# EAGLE design quadcopter (EAGLE 8.2.0)
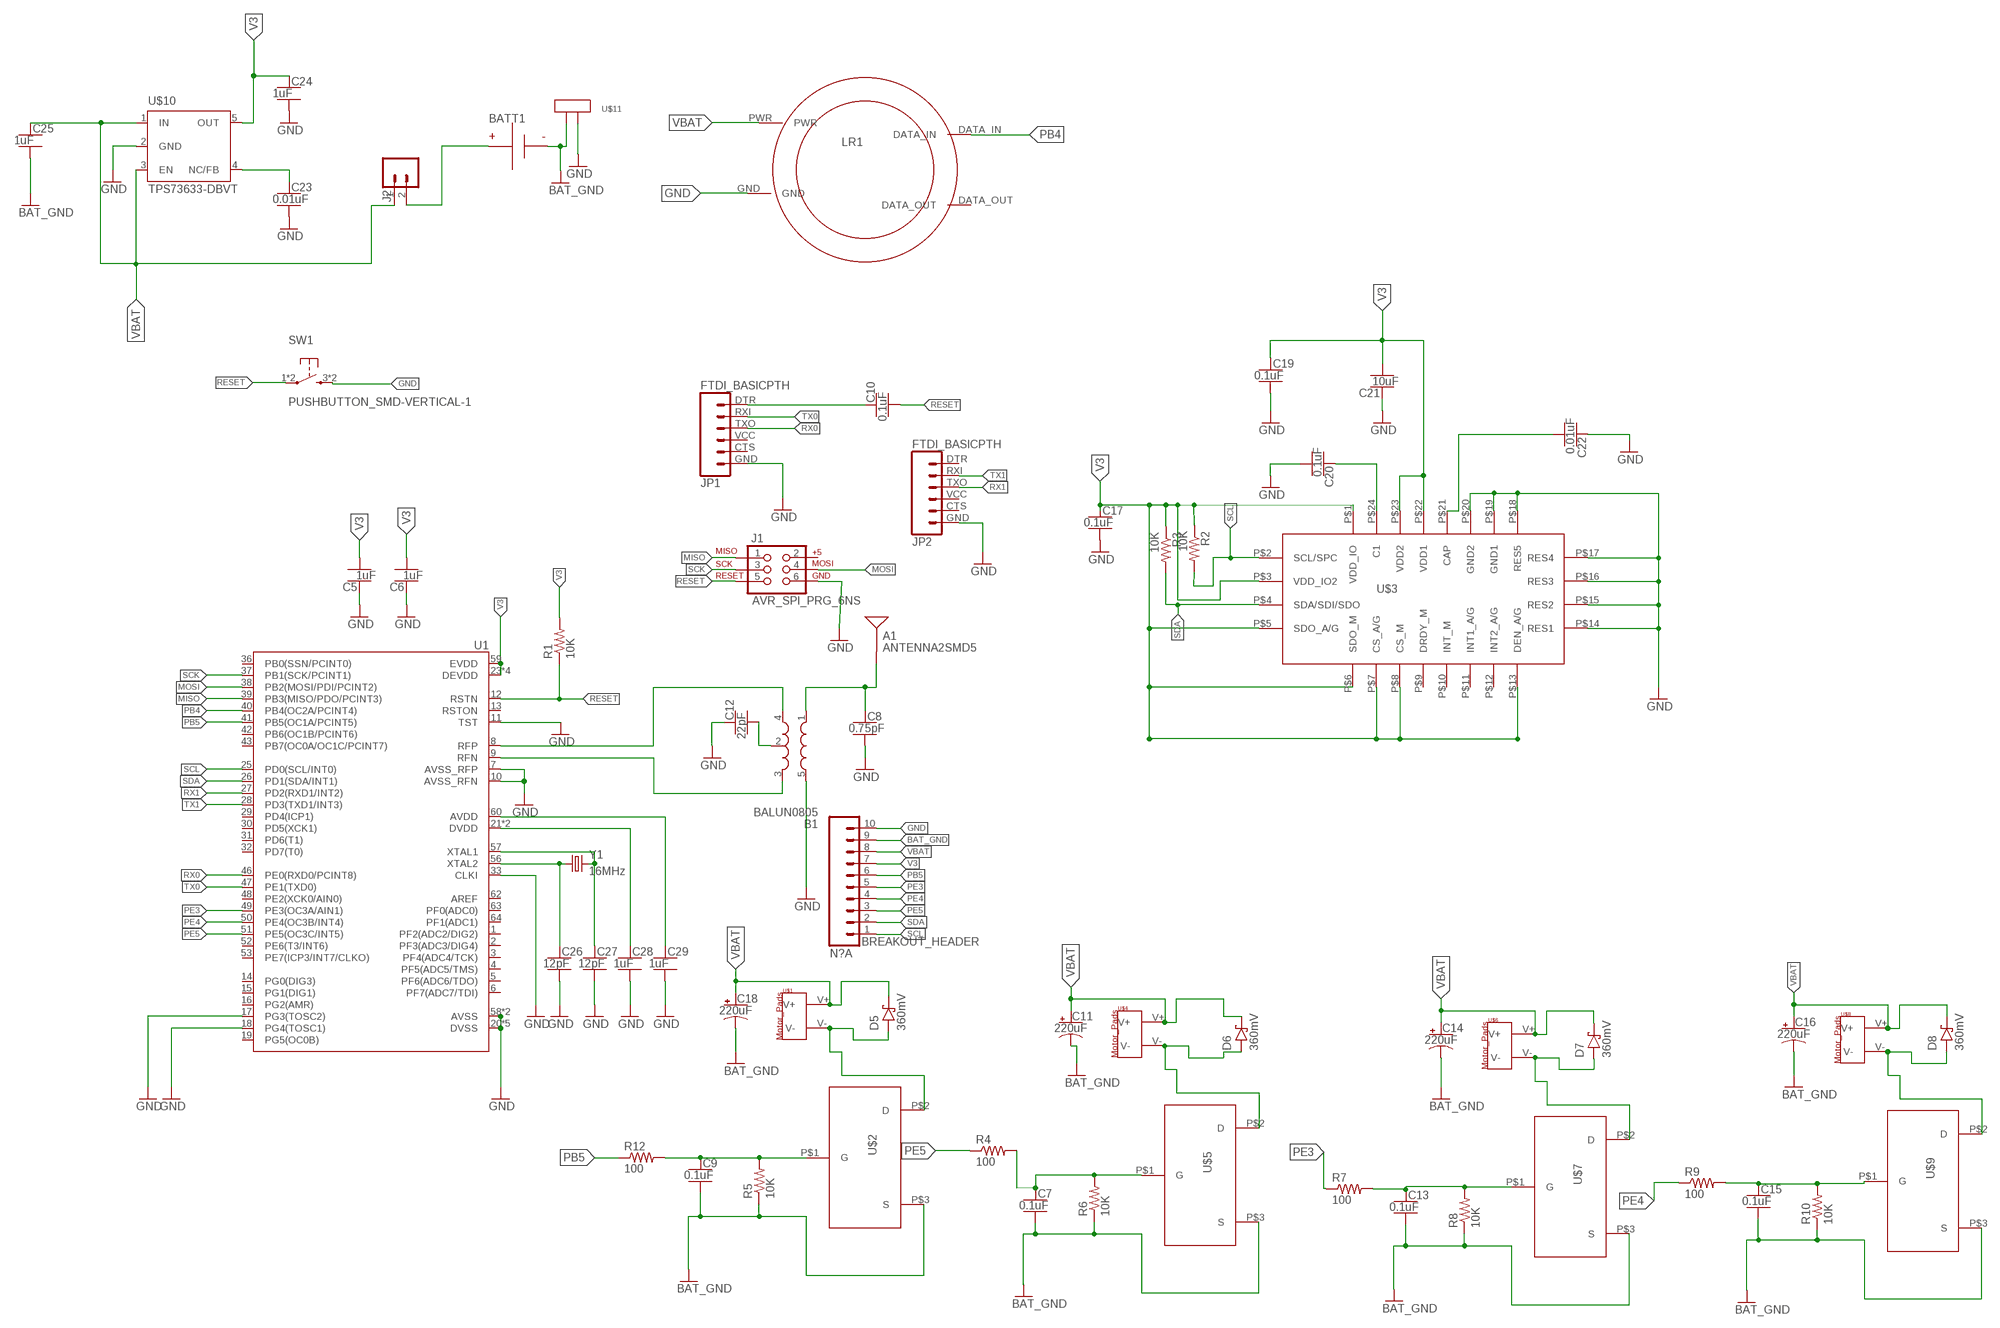
[diagram p0: schematic, sheet 1]

## Parts
A1  ANTENNA2SMD5  [ANTENNA-CHIP5]
B1  BALUN0805  [BALUN]
BATT1  BATTERY-HUBSAN-W/HOLDER  [BATTERY-W/HOLDER-380MAH-HUBSAN]
BREAKOUT_HEADER  N?A  SIP-10_TH-254X10  [HDRV10W63P254_10X1_2540X254H838_HS]
C5  1uF  CAPACITOR-NP_SMD-2012-0805_CERAMIC-1UF  [CAPC2012X140_HS]
C6  1uF  CAPACITOR-NP_SMD-2012-0805_CERAMIC-1UF  [CAPC2012X140_HS]
C7  0.1uF  CERAMIC_CAP-0805-0.1UF  [CERAMIC_CAP_0805]
C8  0.75pF  CAPACITOR-NP_SMD-2012-0805_CERAMIC-0.75PF  [CAPC2012X140_HS]
C9  0.1uF  CERAMIC_CAP-0805-0.1UF  [CERAMIC_CAP_0805]
C10  0.1uF  CAPACITOR-NP_SMD-2012-0805_CERAMIC-0.1UF  [CAPC2012X140_HS]
C11  220uF  CAPACITOR-POL_SMD-7043-D_TANTALUM-220UF  [CAPMP7343X310_HS]
C12  22pF  CAPACITOR-NP_SMD-2012-0805_CERAMIC-22PF  [CAPC2012X140_HS]
C13  0.1uF  CERAMIC_CAP-0805-0.1UF  [CERAMIC_CAP_0805]
C14  220uF  CAPACITOR-POL_SMD-7043-D_TANTALUM-220UF  [CAPMP7343X310_HS]
C15  0.1uF  CERAMIC_CAP-0805-0.1UF  [CERAMIC_CAP_0805]
C16  220uF  CAPACITOR-POL_SMD-7043-D_TANTALUM-220UF  [CAPMP7343X310_HS]
C17  0.1uF  CAPACITOR-NP_SMD-2012-0805_CERAMIC-0.1UF  [CAPC2012X140_HS]
C18  220uF  CAPACITOR-POL_SMD-7043-D_TANTALUM-220UF  [CAPMP7343X310_HS]
C19  0.1uF  CAPACITOR-NP_SMD-2012-0805_CERAMIC-0.1UF  [CAPC2012X140_HS]
C20  0.1uF  CAPACITOR-NP_SMD-2012-0805_CERAMIC-0.1UF  [CAPC2012X140_HS]
C21  10uF  CAPACITOR-NP_SMD-2012-0805_CERAMIC-10UF  [CAPC2012X140_HS]
C22  0.01uF  CAPACITOR-NP_SMD-2012-0805_CERAMIC-0.01UF  [CAPC2012X140_HS]
C23  0.01uF  CAPACITOR-NP_SMD-2012-0805_CERAMIC-0.01UF  [CAPC2012X140_HS]
C24  1uF  CAPACITOR-NP_SMD-2012-0805_CERAMIC-1UF  [CAPC2012X140_HS]
C25  1uF  CAPACITOR-NP_SMD-2012-0805_CERAMIC-1UF  [CAPC2012X140_HS]
C26  12pF  CAPACITOR-NP_SMD-2012-0805_CERAMIC-12PF  [CAPC2012X140_HS]
C27  12pF  CAPACITOR-NP_SMD-2012-0805_CERAMIC-12PF  [CAPC2012X140_HS]
C28  1uF  CAPACITOR-NP_SMD-2012-0805_CERAMIC-1UF  [CAPC2012X140_HS]
C29  1uF  CAPACITOR-NP_SMD-2012-0805_CERAMIC-1UF  [CAPC2012X140_HS]
D5  360mV  DIODE-SCHOTTKY_SMD-SOD123-360MV  [SOD3716X135_HS]
D6  360mV  DIODE-SCHOTTKY_SMD-SOD123-360MV  [SOD3716X135_HS]
D7  360mV  DIODE-SCHOTTKY_SMD-SOD123-360MV  [SOD3716X135_HS]
D8  360mV  DIODE-SCHOTTKY_SMD-SOD123-360MV  [SOD3716X135_HS]
J1  AVR_SPI_PRG_6NS  [2X3-NS]
J2  MALE_HEADER_2POS-2X1-0.1IN  [MALE_HEADER_2X1_0.1IN]
JP1  FTDI_BASICPTH  [FTDI_BASIC]
JP2  FTDI_BASICPTH  [FTDI_BASIC]
LR1  LED_RING  [LED_RING]
R1  10K  RESISTOR_SMD-2012-0805-10K  [RESC2012X60_HS]
R2  10K  RESISTOR_SMD-2012-0805-10K  [RESC2012X60_HS]
R3  10K  RESISTOR_SMD-2012-0805-10K  [RESC2012X60_HS]
R4  100  RESISTOR_SMD-2012-0805-100  [RESC2012X60_HS]
R5  10K  RESISTOR_SMD-2012-0805-10K  [RESC2012X60_HS]
R6  10K  RESISTOR_SMD-2012-0805-10K  [RESC2012X60_HS]
R7  100  RESISTOR_SMD-2012-0805-100  [RESC2012X60_HS]
R8  10K  RESISTOR_SMD-2012-0805-10K  [RESC2012X60_HS]
R9  100  RESISTOR_SMD-2012-0805-100  [RESC2012X60_HS]
R10  10K  RESISTOR_SMD-2012-0805-10K  [RESC2012X60_HS]
R12  100  RESISTOR_SMD-2012-0805-100  [RESC2012X60_HS]
SW1  PUSHBUTTON_SMD-VERTICAL-1  [TE_FSM8JSMA_HS]
U1  ATMEGA128RFA1  [QFN-64]
U$1  MOTOR_PADS  [MOTOR_PADS]
U$2  N-CHANNEL_MOSFET  [N-CHANNELMOFSET]
U$3  9-AXIS_IMU  [9-AXIS_IMU]
U$4  MOTOR_PADS  [MOTOR_PADS]
U$5  N-CHANNEL_MOSFET  [N-CHANNELMOFSET]
U$6  MOTOR_PADS  [MOTOR_PADS]
U$7  N-CHANNEL_MOSFET  [N-CHANNELMOFSET]
U$8  MOTOR_PADS  [MOTOR_PADS]
U$9  N-CHANNEL_MOSFET  [N-CHANNELMOFSET]
U$10  TPS73633-DBVT  [SOT23-DBV]
U$11  NET_BRIDGE  [NET_BRIDGE]
Y1  16MHz  CRYSTAL5X3  [CRYSTAL-SMD-5X3]

## Nets
BAT_GND [HIGHCURRENT]: BATT1.-(N) BREAKOUT_HEADER.9 C7.2 C9.2 C11.2(-) C13.2 C14.2(-) C15.2 C16.2(-) C18.2(-) C25.2 R5.1 R6.1 R8.1 R10.1 U$2.P$3(S) U$5.P$3(S) U$7.P$3(S) U$9.P$3(S) U$11.P$1
GND: B1.5(GND) BREAKOUT_HEADER.10 C5.1 C6.1 C8.2 C12.1 C17.2 C19.2 C20.2 C21.1 C22.1 C23.2 C24.2 C26.2 C27.2 C28.2 C29.2 J1.6 JP1.GND JP2.GND LR1.GND SW1.3 SW1.4 U1.7(AVSS_RFP) U1.10(AVSS_RFN) U1.11(TST) U1.17(PG3(TOSC2)) U1.18(PG4(TOSC1)) U1.20(DVSS) U1.24(DVSS) U1.33(CLKI) U1.35(DVSS) U1.45(DVSS) U1.55(DVSS) U1.58(AVSS) U1.61(AVSS) U$3.P$14(RES1) U$3.P$15(RES2) U$3.P$16(RES3) U$3.P$17(RES4) U$3.P$18(RES5) U$3.P$19(GND1) U$3.P$20(GND2) U$10.2(GND) U$11.P$2
MISO: J1.1 U1.39(PB3(MISO/PDO/PCINT3))
MOSI: J1.4 U1.38(PB2(MOSI/PDI/PCINT2))
N$1 [HIGHCURRENT]: C9.1 R5.2 R12.2 U$2.P$1(G)
N$2 [HIGHCURRENT]: C7.1 R4.2 R6.2 U$5.P$1(G)
N$4 [RFSIG]: A1.FEED(SIGNAL) B1.1(IN) C8.1
N$8: B1.2(GND) C12.2
N$10: C10.1 JP1.DTR
N$13 [HIGHCURRENT]: D6.A U$4.V- U$5.P$2(D)
N$14 [HIGHCURRENT]: C13.1 R7.2 R8.2 U$7.P$1(G)
N$16 [HIGHCURRENT]: D5.A U$1.V- U$2.P$2(D)
N$17 [HIGHCURRENT]: D7.A U$6.V- U$7.P$2(D)
N$18 [HIGHCURRENT]: C15.1 R9.2 R10.2 U$9.P$1(G)
N$19 [HIGHCURRENT]: D8.A U$8.V- U$9.P$2(D)
N$21: C20.1 U$3.P$24(C1)
N$23: C22.2 U$3.P$21(CAP)
N$24: C26.1 U1.56(XTAL2) Y1.1
N$25 [HIGHCURRENT]: BATT1.+(P) J2.2
N$27 [HIGHCURRENT]: C23.1 U$10.4(NC/FB)
N$36: B1.4(OUT1) U1.8(RFP)
N$37: B1.3(OUT2) U1.9(RFN)
N$40: C29.1 U1.60(AVDD)
N$41: C28.1 U1.21(DVDD) U1.22(DVDD)
N$43: C27.1 U1.57(XTAL1) Y1.3
PB4: LR1.DATA_IN U1.40(PB4(OC2A/PCINT4))
PB5: BREAKOUT_HEADER.6 R12.1 U1.41(PB5(OC1A/PCINT5))
PE3: BREAKOUT_HEADER.5 R7.1 U1.49(PE3(OC3A/AIN1))
PE4: BREAKOUT_HEADER.4 R9.1 U1.50(PE4(OC3B/INT4))
PE5: BREAKOUT_HEADER.3 R4.1 U1.51(PE5(OC3C/INT5))
RESET: C10.2 J1.5 R1.1 SW1.1 SW1.2 U1.12(RSTN)
RX0: JP1.TXO U1.46(PE0(RXD0/PCINT8))
RX1: JP2.TXO U1.27(PD2(RXD1/INT2))
SCK: J1.3 U1.37(PB1(SCK/PCINT1))
SCL: BREAKOUT_HEADER.1 R2.2 U1.25(PD0(SCL/INT0)) U$3.P$2(SCL/SPC)
SDA: BREAKOUT_HEADER.2 R3.2 U1.26(PD1(SDA/INT1)) U$3.P$4(SDA/SDI/SDO)
TX0: JP1.RXI U1.47(PE1(TXD0))
TX1: JP2.RXI U1.28(PD3(TXD1/INT3))
V3: BREAKOUT_HEADER.7 C5.2 C6.2 C17.1 C19.1 C21.2 C24.1 R1.2 R2.1 R3.1 U1.23(DEVDD) U1.34(DEVDD) U1.44(DEVDD) U1.54(DEVDD) U1.59(EVDD) U$3.P$1(VDD_IO) U$3.P$3(VDD_IO2) U$3.P$5(SDO_A/G) U$3.P$6(SDO_M) U$3.P$7(CS_A/G) U$3.P$8(CS_M) U$3.P$13(DEN_A/G) U$3.P$22(VDD1) U$3.P$23(VDD2) U$10.5(OUT)
VBAT [HIGHCURRENT]: BREAKOUT_HEADER.8 C11.1(+) C14.1(+) C16.1(+) C18.1(+) C25.1 D5.C D6.C D7.C D8.C J2.1 LR1.PWR U$1.V+ U$4.V+ U$6.V+ U$8.V+ U$10.1(IN) U$10.3(EN)
Unconnected: J1.2 JP1.CTS JP1.VCC JP2.CTS JP2.DTR JP2.VCC LR1.DATA_OUT U1.1(PF2(ADC2/DIG2)) U1.2(PF3(ADC3/DIG4)) U1.3(PF4(ADC4/TCK)) U1.4(PF5(ADC5/TMS)) U1.5(PF6(ADC6/TDO)) U1.6(PF7(ADC7/TDI)) U1.13(RSTON) U1.14(PG0(DIG3)) U1.15(PG1(DIG1)) U1.16(PG2(AMR)) U1.19(PG5(OC0B)) U1.29(PD4(ICP1)) U1.30(PD5(XCK1)) U1.31(PD6(T1)) U1.32(PD7(T0)) U1.36(PB0(SSN/PCINT0)) U1.42(PB6(OC1B/PCINT6)) U1.43(PB7(OC0A/OC1C/PCINT7)) U1.48(PE2(XCK0/AIN0)) U1.52(PE6(T3/INT6)) U1.53(PE7(ICP3/INT7/CLKO)) U1.62(AREF) U1.63(PF0(ADC0)) U1.64(PF1(ADC1)) U$3.P$9(DRDY_M) U$3.P$10(INT_M) U$3.P$11(INT1_A/G) U$3.P$12(INT2_A/G)

## Library data of the parts
A1 = quadparts_prebuilt:ANTENNA2: Chip antenna Single endded antenna. Common with smaller chip antennas. CHIP4 package is the GPS Chip Antenna SKU: GPS-08418. CHIP5 package is 2.4GHz chip antenna SKU: WRL-00144.; DATASHEET: http://www.linxtechnologies.com/resources/data-guides/ant-xxx-chp-x.pdf; DIST: Digikey; DISTPN: ANT-2.45-CHPCT-ND; MFR: Linx Technologies Inc.; MPN: ANT-2.45-CHP-T; PRICE: 3.16
B1 = quadparts_prebuilt:BALUN: 0805 footprint balun- Ember 351/357; DATASHEET: http://katalog.we-online.de/pbs/datasheet/748421245.pdf; DIST: Digikey; DISTPN: 732-2230-6-ND; MFR: Wurth Electronics Inc; MPN: 748421245; PRICE: 2.63
BATT1 = quadparts_prebuilt:BATTERY; CREATOR: Swanson; DIST: AMAZON; DISTPN: http://www.amazon.com/dp/B00RROB6Q4?smid=AMNTPWSAB5H0S; MFR: HUBSAN; MPN: X4-H107C-8-in-1
BREAKOUT_HEADER = quadparts_prebuilt:SIP-10_: 10 pin single inline pin header, socket, or connector; DATASHEET: http://portal.fciconnect.com/Comergent//fci/drawing/68000.pdf; DIST: Digikey; DISTPN: 609-3250-ND; MFR: Amphenol FCI; MPN: 68000-110HLF; PRICE: 0.55
C5 C6 C24 C25 C28 C29 = quadparts_prebuilt:CAPACITOR-NP_: Nonpolarized capacitor; DIST: Digikey; DISTPN: 490-4736-1-ND; MFR: Murata Electronics North America; MPN: GRM21BR71H105KA12L
C7 C9 C13 C15 = quadparts_Jason:CERAMIC_CAP: Nonpolarized capacitor; CREATOR: SWANSON; DIST: Digikey; DISTPN: 490-1666-1-ND; MFR: Murata Electronics North America; MPN: GRM21BR71H104KA01L
C8 = quadparts_prebuilt:CAPACITOR-NP_: Nonpolarized capacitor; DIST: Digikey; DISTPN: 490-3585-1-ND; MFR: Murata Electronics North America; MPN: GQM2195C2AR75CB01D
C10 C17 C19 C20 = quadparts_prebuilt:CAPACITOR-NP_: Nonpolarized capacitor; DIST: Digikey; DISTPN: 490-1666-1-ND; MFR: Murata Electronics North America; MPN: GRM21BR71H104KA01L
C11 C14 C16 C18 = quadparts_prebuilt:CAPACITOR-POL_: Polarized capacitor; DIST: Digikey; DISTPN: 478-8912-1-ND; MFR: AVX Corporation; MPN: TAJD227K006RNJ
C12 = quadparts_prebuilt:CAPACITOR-NP_: Nonpolarized capacitor; DIST: Digikey; DISTPN: 490-5534-1-ND; MFR: Murata Electronics North America; MPN: GRM21A5C2E220JW01D
C21 = quadparts_prebuilt:CAPACITOR-NP_: Nonpolarized capacitor; DIST: Digikey; DISTPN: 490-5523-1-ND; MFR: Murata Electronics North America; MPN: GRM21BR61E106KA73L
C22 C23 = quadparts_prebuilt:CAPACITOR-NP_: Nonpolarized capacitor; DIST: Digikey; DISTPN: 490-8295-1-ND; MFR: Murata Electronics North America; MPN: GRM2195C1H103FA01D
C26 C27 = quadparts_prebuilt:CAPACITOR-NP_: Nonpolarized capacitor; DIST: Digikey; DISTPN: 490-5531-1-ND; MFR: Murata Electronics North America; MPN: GRM21A5C2E120JW01D
D5-D8 = quadparts_prebuilt:DIODE-SCHOTTKY_: Schottky diode; DIST: Digikey; DISTPN: CRS08QMCT-ND; MFR: Toshiba Semiconductor and Storage; MPN: CRS08(TE85L,Q,M)
J1 = quadparts_prebuilt:AVR_SPI_PRG_6: AVR ISP 6 Pin This is the reduced ISP connector for AVR programming. Common on Arduino. This footprint will take up less PCB space and can be used with a 10-pin to 6-pin adapter such as SKU: BOB-08508; DATASHEET: http://portal.fciconnect.com/Comergent//fci/drawing/67996.pdf; DIST: Digikey; DISTPN: 609-3234-ND; MFR: Amphenol FCI; MPN: 67997-206HLF; PRICE: 0.31
J2 = quadparts_Jason:MALE_HEADER_2POS: 2 pin single inline pin header, socket, or connector; CREATOR: SWANSON; DIST: Digikey; DISTPN: 3M9447-ND; MFR: 3M; MPN: 961102-6404-AR
JP1 JP2 = quadparts_prebuilt:FTDI_BASIC: FTDI Basic header with labels; DATASHEET: http://portal.fciconnect.com/Comergent//fci/drawing/68015.pdf; DIST: Digikey; DISTPN: 609-3327-ND; MFR: Amphenol FCI; MPN: 68016-406HLF; PRICE: 0.33
LR1 = LEDs:LED_RING; CREATOR: Zhe Wang; DIST: DIGIKEY; DISTPN: 1528-1099-ND; MFR: Adafruit Industries LLC; MPN: 1586
R1-R3 R5 R6 R8 R10 = quadparts_prebuilt:RESISTOR_: Resistor; DIST: Digikey; DISTPN: 311-10KARCT-ND; MFR: Yageo; MPN: RC0805JR-0710KL
R4 R7 R9 R12 = quadparts_prebuilt:RESISTOR_: Resistor; DIST: Digikey; DISTPN: 311-100ARCT-ND; MFR: Yageo; MPN: RC0805JR-07100RL
SW1 = quadparts_prebuilt:PUSHBUTTON_: Pushbutton with 2 pins shorting 1 to 2 and two extra mounting pins 3 & 4; DIST: Digikey; DISTPN: 450-1129-ND; MFR: TE Connectivity Alcoswitch Switches; MPN: FSM4JSMA
U1 = quadparts_prebuilt:ATMEGA128RFA1: ATmega128RFA1 8-bit AVR Microcontroller with Low Power 2.4GHz Transceiver for ZigBee and IEEE 802.15.4; CREATOR: Swanson; DATASHEET: http://www.atmel.com/Images/Atmel-8266-MCU_Wireless-ATmega128RFA1_Datasheet.pdf; DIST: Digikey; DISTPN: ATMEGA128RFA1-ZUR00DKR-ND; MFR: Atmel; MPN: ATMEGA128RFA1-ZUR00; PRICE: 10.21
U$1 U$4 U$6 U$8 = quadparts_prebuilt:MOTOR_PADS; DIST: NA; DISTPN: NA; MFR: NA; MPN: NA
U$2 U$5 U$7 U$9 = quadparts_Jason:N-CHANNEL_MOSFET; CREATOR: Jason_Wong; DIST: Digikey; DISTPN: SI2302CDS-T1-E3CT-ND; MFR: Vishay Siliconix; MPN: SI2302CDS-T1-E3
U$3 = quadparts_Jason:9-AXIS_IMU; CREATOR: Jason_Wong; DIST: Digikey; DISTPN: 497-14946-1-ND; MFR: STMicroelectronics; MPN: LSM9DS1TR
U$10 = quadparts_prebuilt:TPS73633-DBVT; DATASHEET: http://www.ti.com/lit/ds/symlink/lp3985.pdf; DIST: Digikey; DISTPN: LP3985IM5X-3.0/NOPBCT-ND; MFR: Texas Instruments; MPN: LP3985IM5X-3.0/NOPB; PRICE: 0.59
U$11 = quadparts_Zhe:NET_BRIDGE; CREATOR: Zhe; DIST: NONE; DISTPN: 11-22-3-4-5; MFR: NONE; MPN: 123-456-789; REVIEWER: NONE
Y1 = quadparts_prebuilt:CRYSTAL: Various standard crystals. Proven footprints.; DATASHEET: http://www.abracon.com/Resonators/abm3b.pdf; DIST: Digikey; DISTPN: 535-9122-1-ND; MFR: Abracon LLC; MPN: ABM3B-16.000MHZ-B2-T; PRICE: 0.68; PROD_ID: XTAL-08218

## Net classes
1 RFSIG: width 0.457 mm
2 HIGHCURRENT: width 0.457 mm

## Board
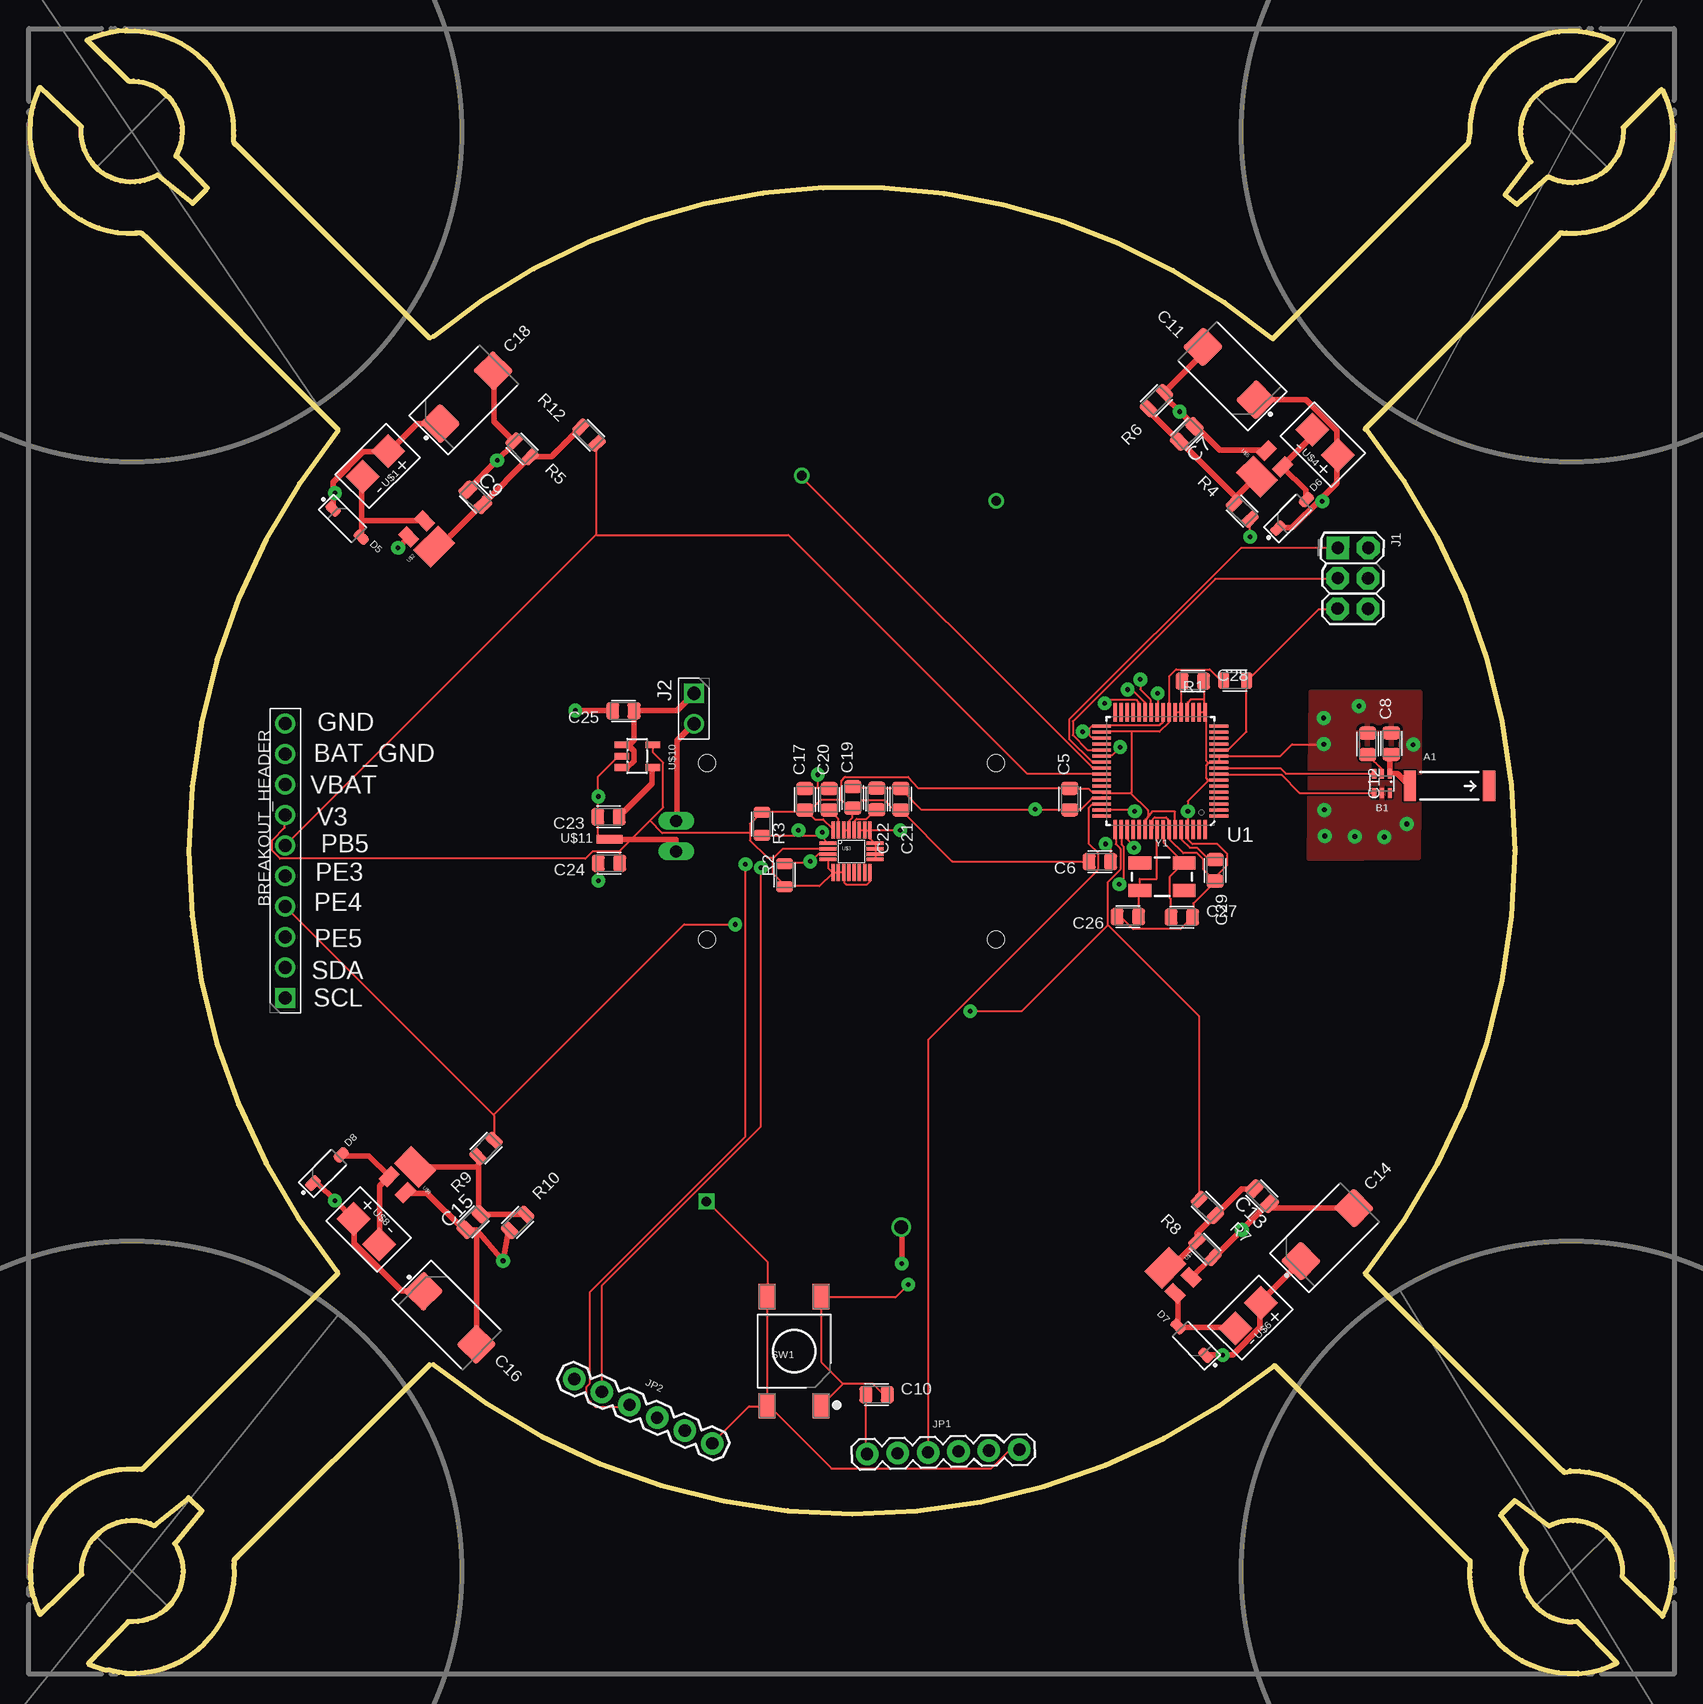
[diagram p1: board, top side]
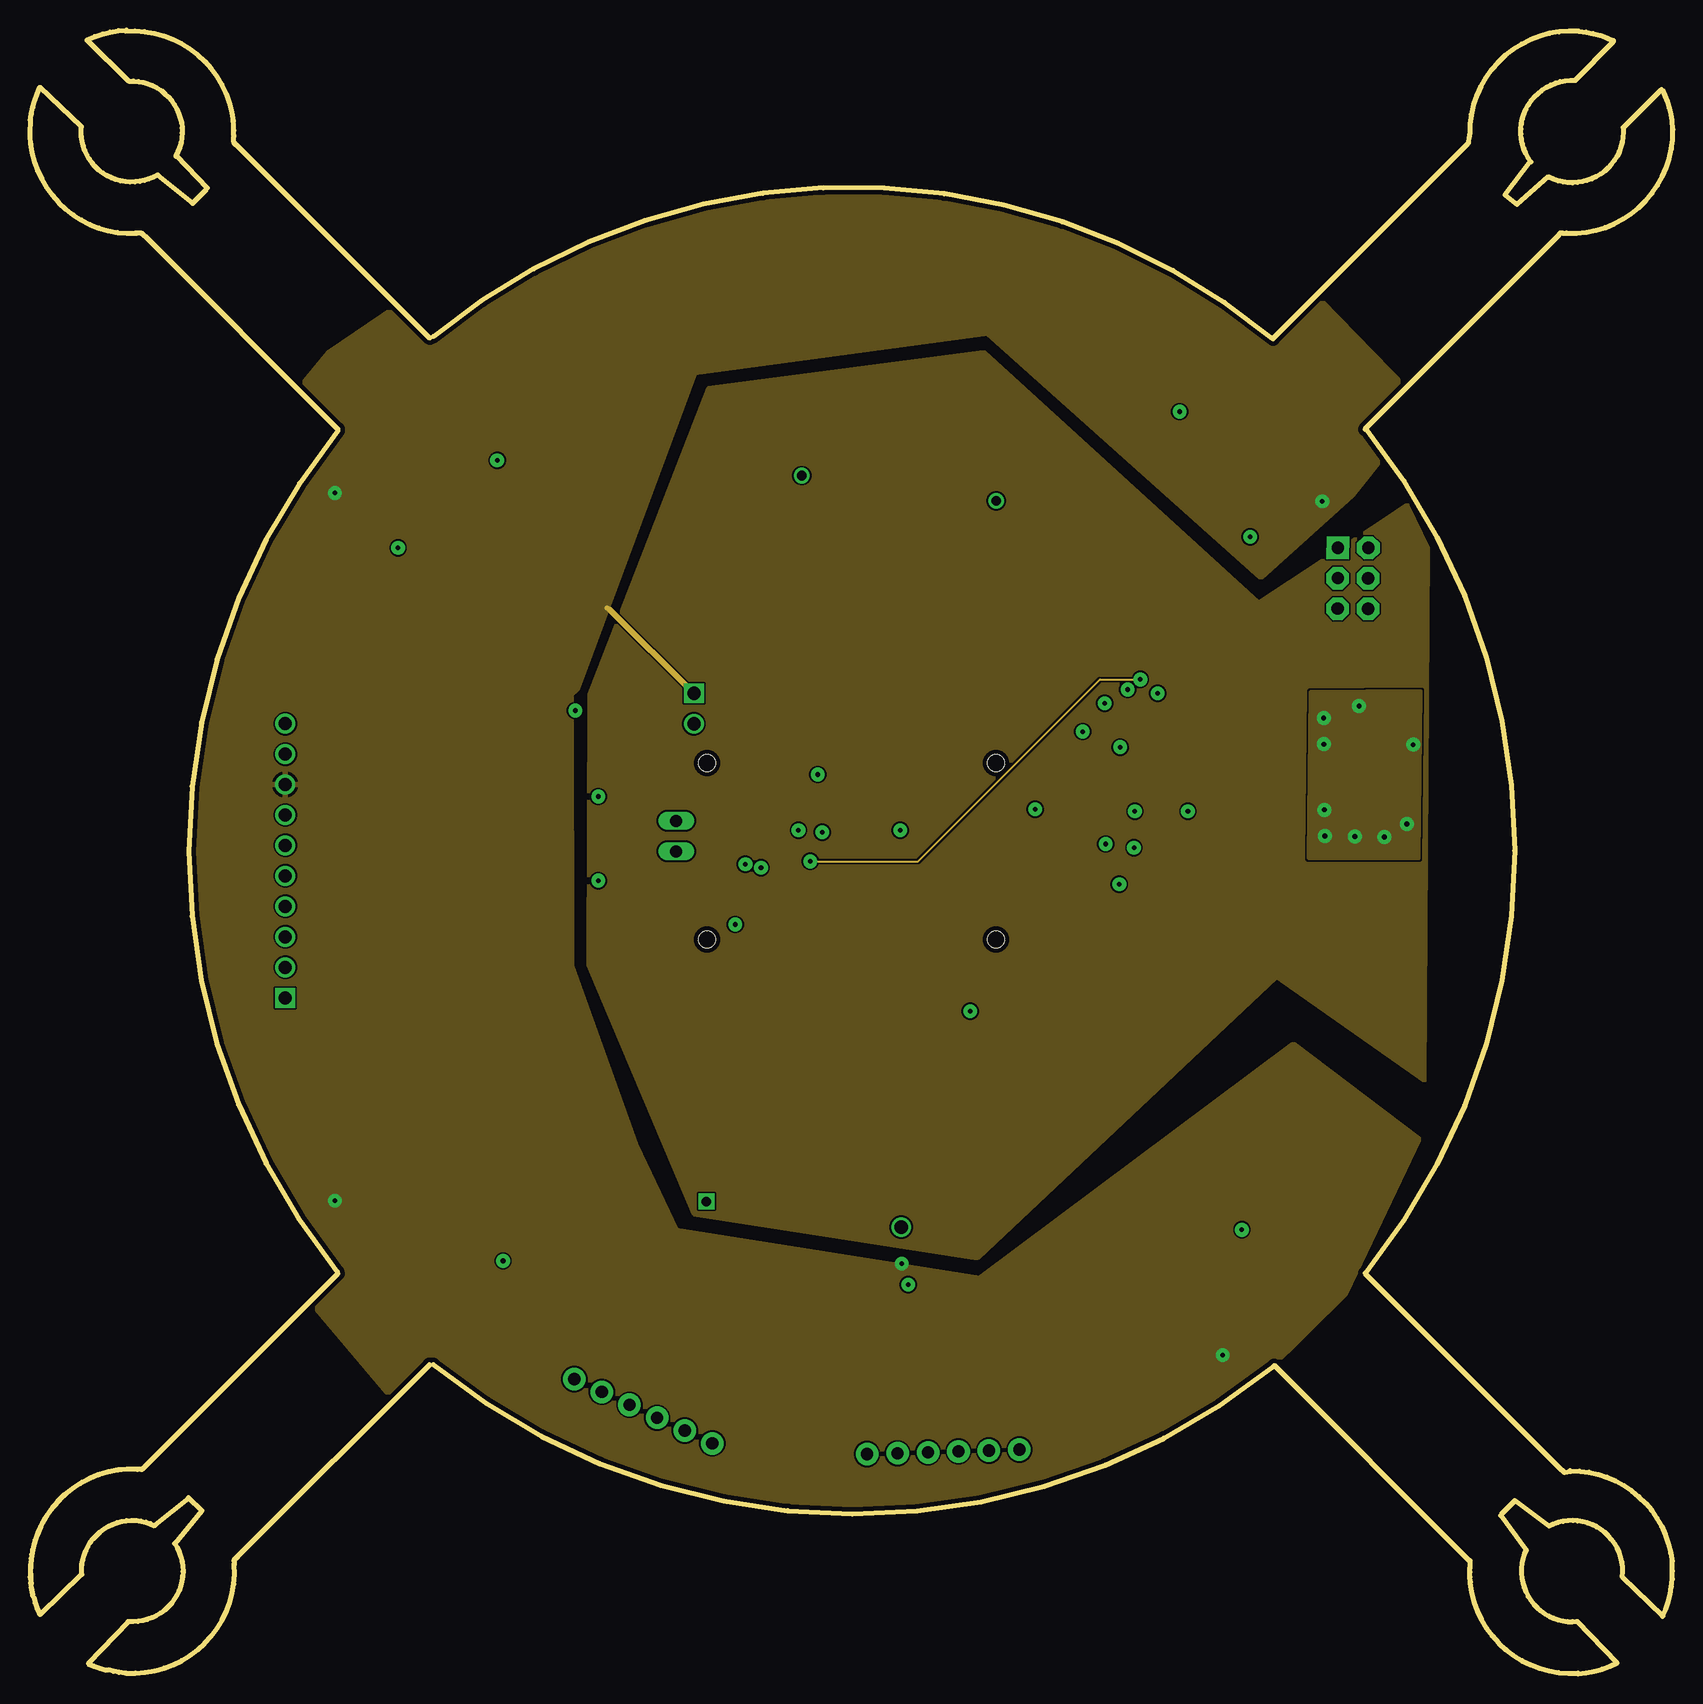
[diagram p2: board, inner layer Route2]
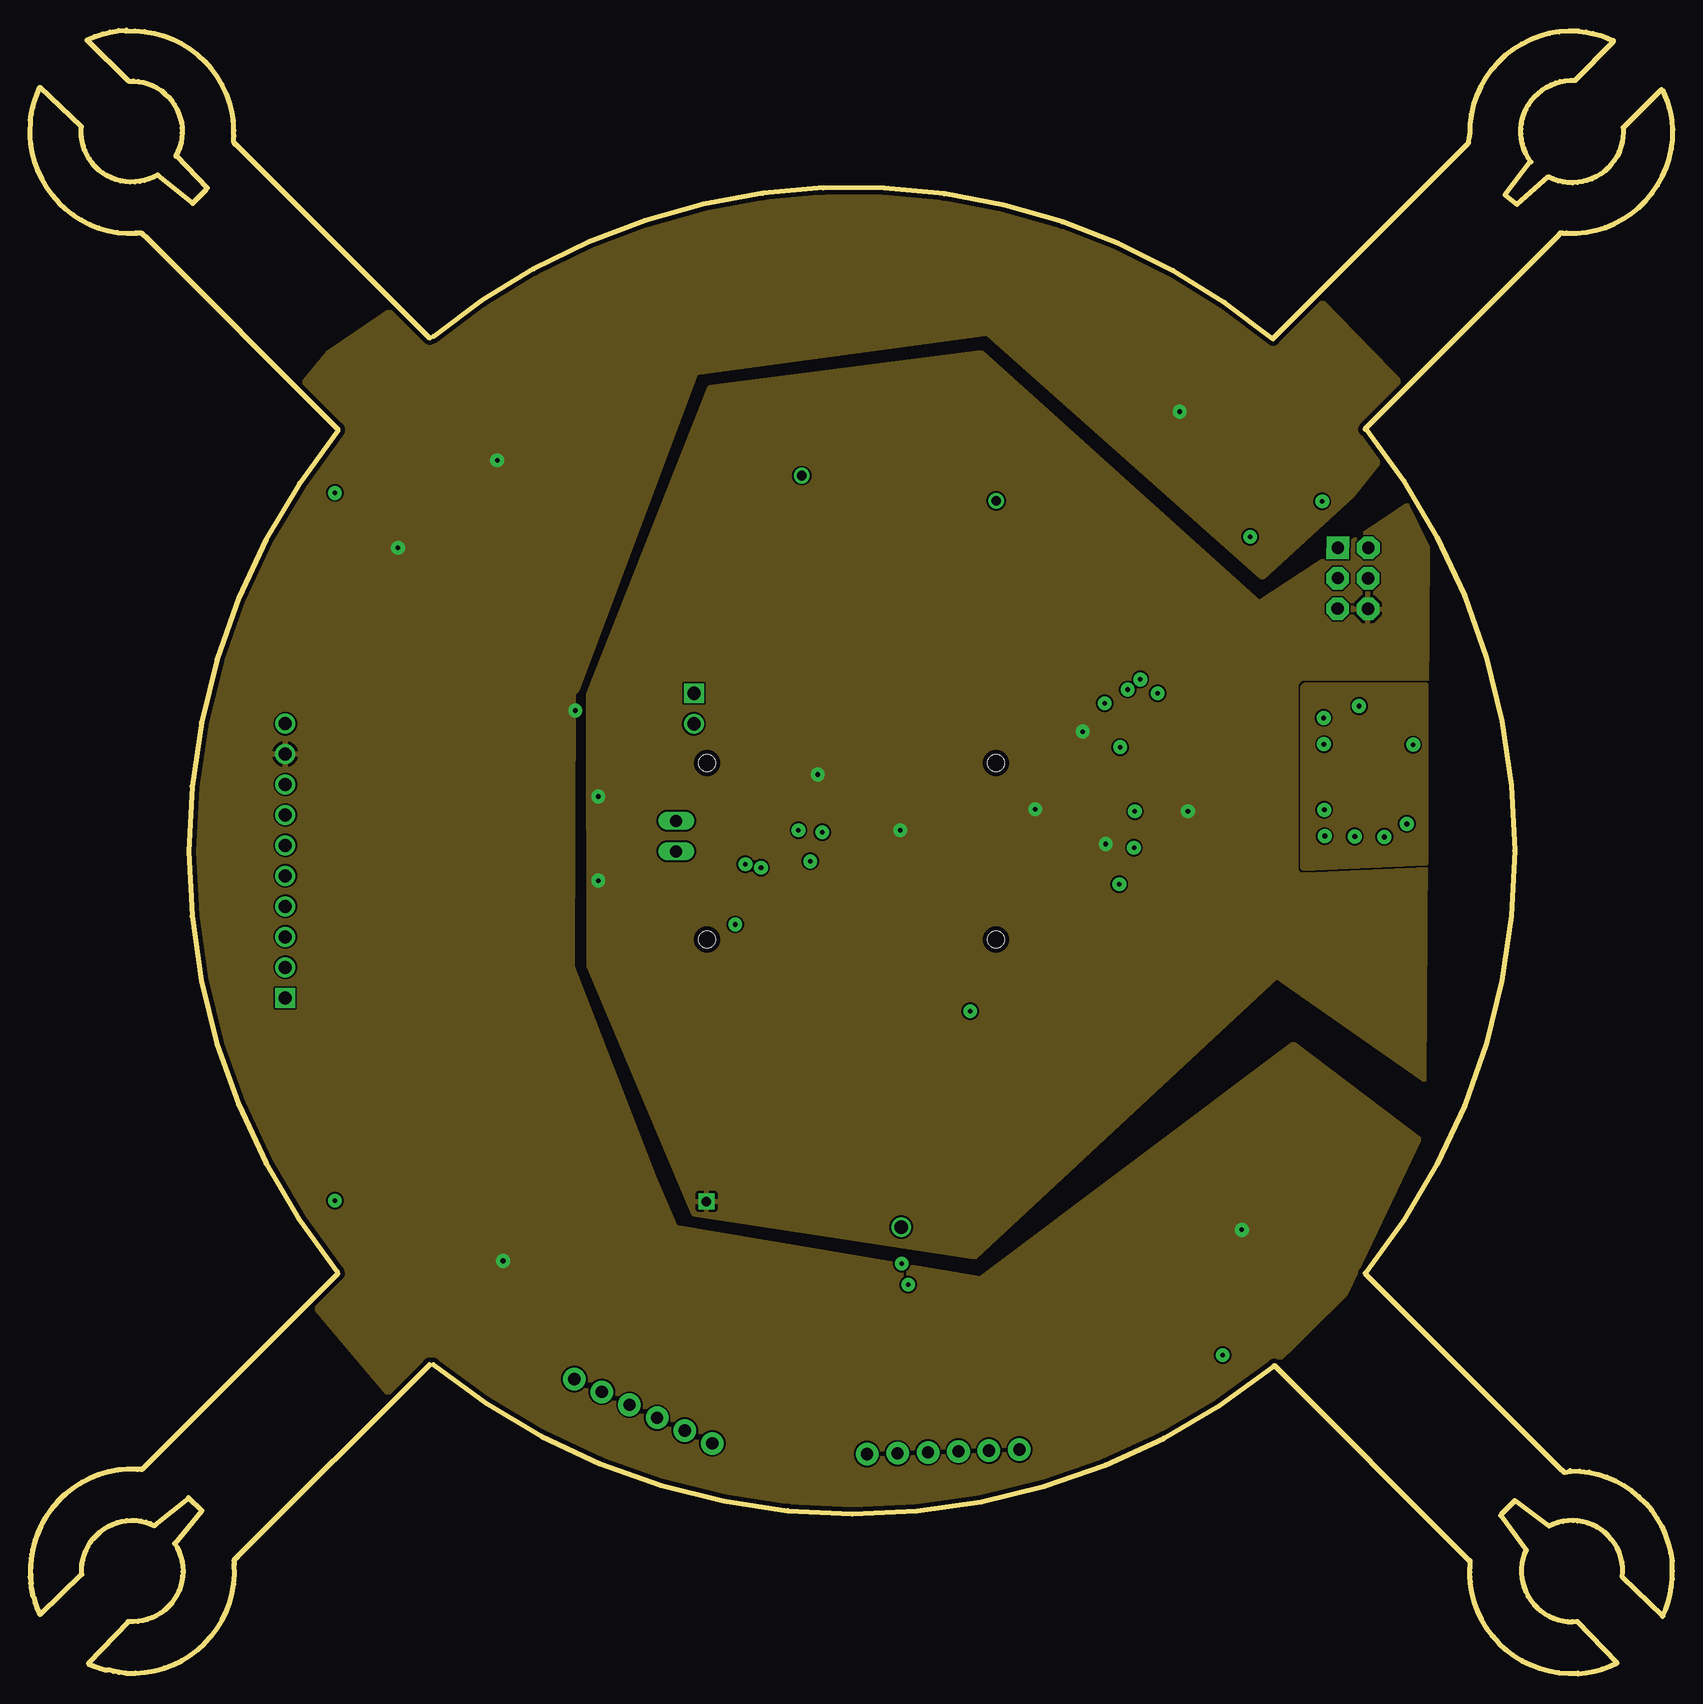
[diagram p3: board, inner layer Route15]
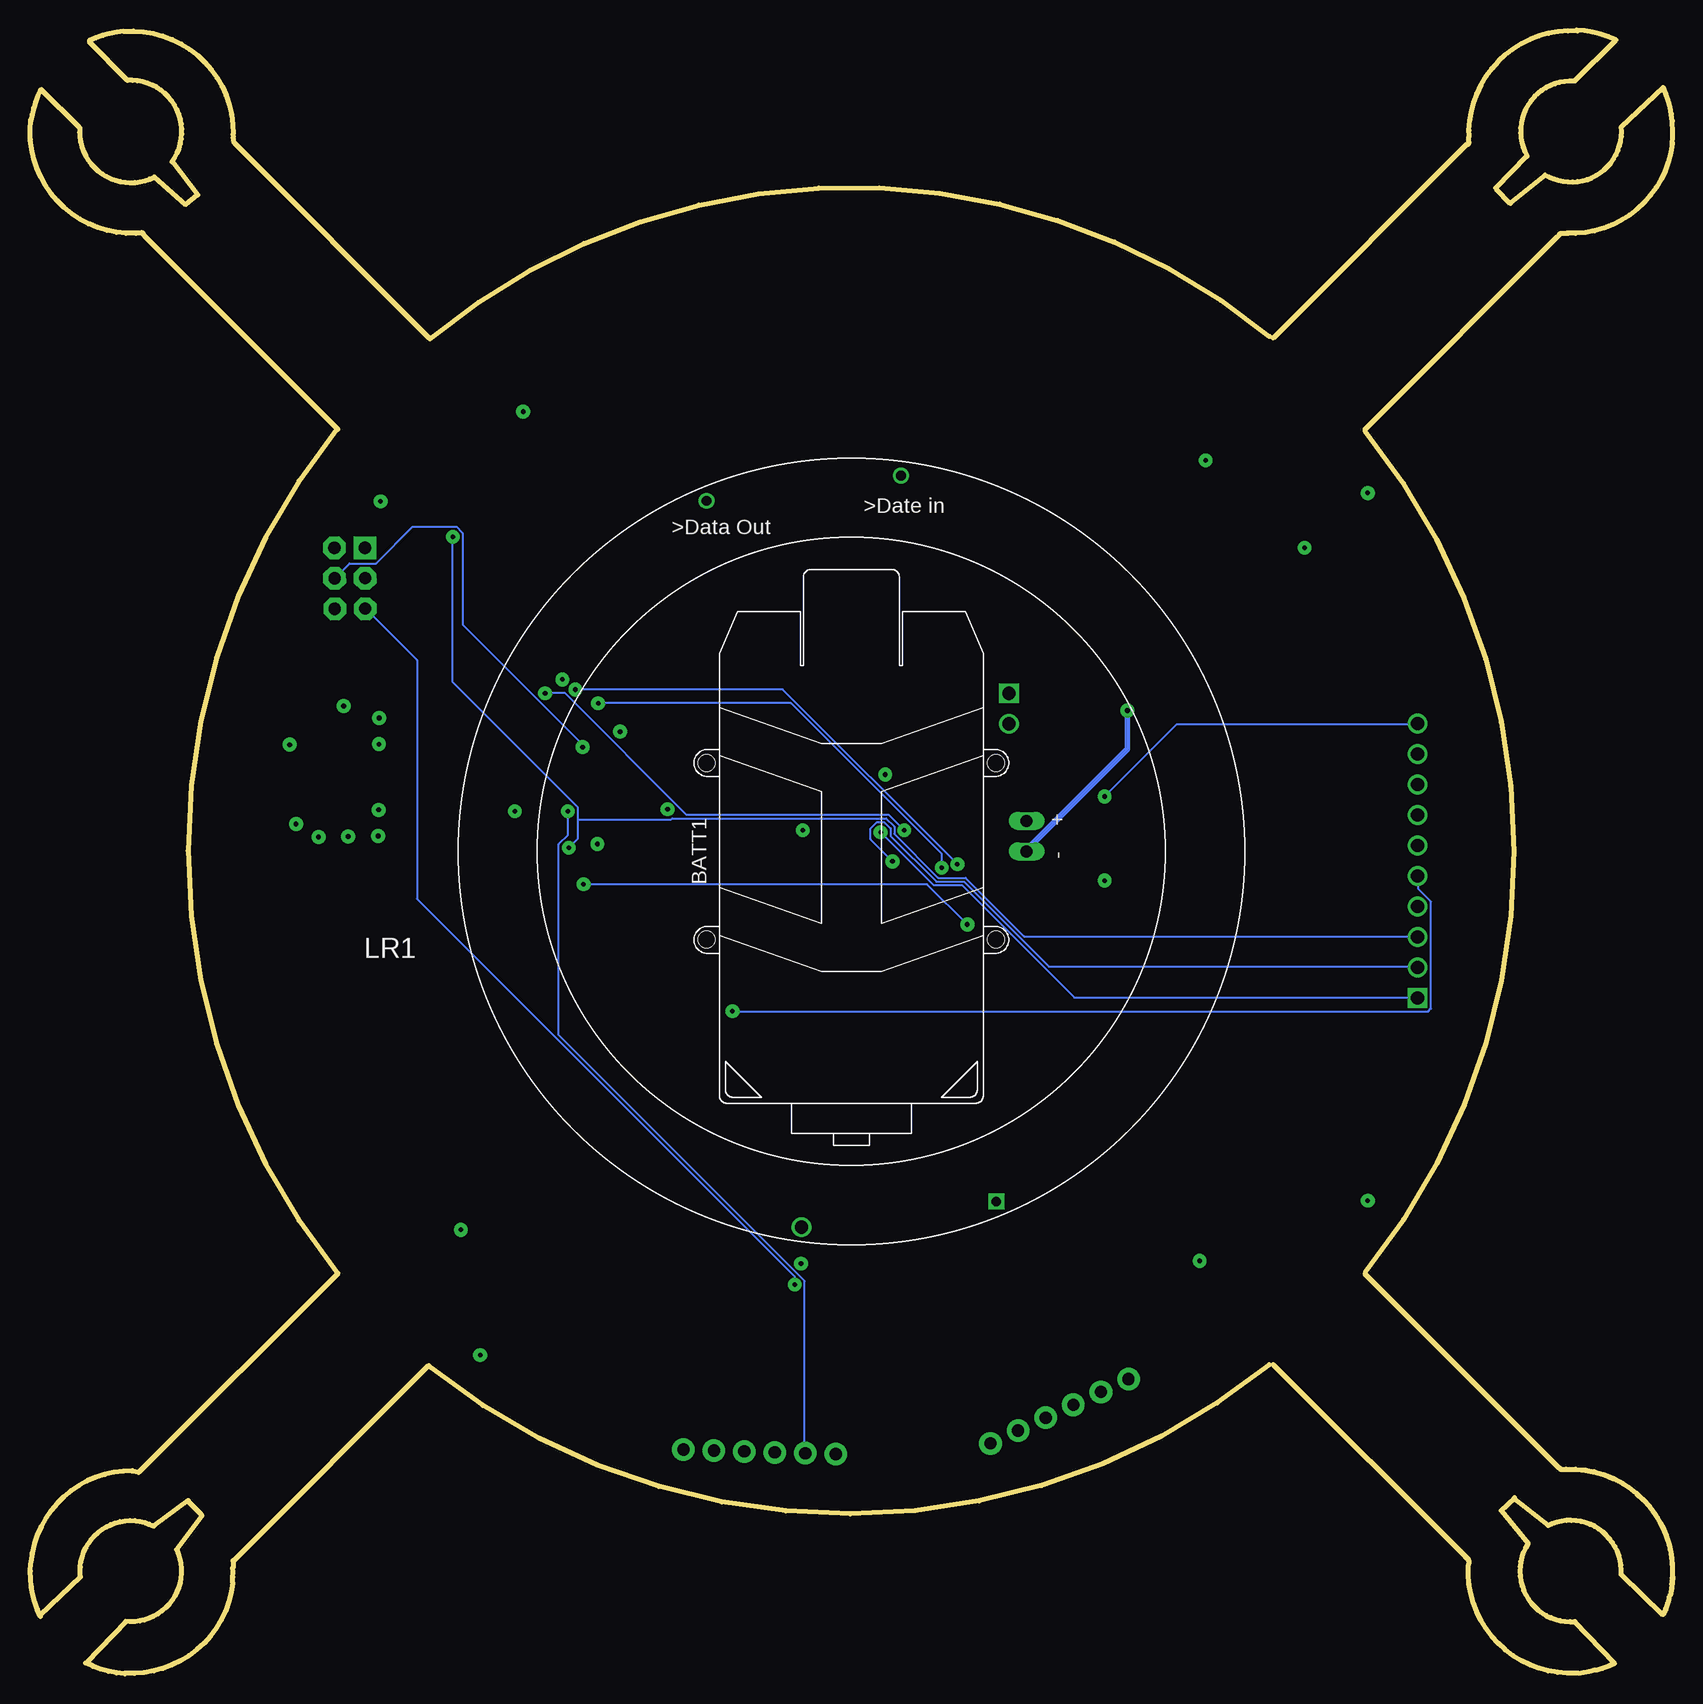
[diagram p4: board, bottom side, seen from below]

Size 136.94 x 137.03 mm. Coordinates in mm from the lower left corner, seen from the top.
Outline: 25.66,103.6 arc78 25.62,33.52
Outline: 103.62,111.27 arc79 33.63,111.48
Outline: 111.32,103.83 arc-78 111.31,33.4
Outline: 33.64,25.76 arc78 103.55,25.54
Outline: 0,8.05 arc10 0.22,6.57
Outline: 9.62,17.32 25.66,33.36
Outline: 0.05,8 arc-96 8.92,17.07 arc100 0.1,7.47
Outline: 33.31,25.77 17.32,9.78
Outline: 8,0.07 arc97 17.04,9.1
Outline: 111.28,33.38 127.66,17
Outline: 128.39,16.93 arc-85 136.88,9.31
Outline: 119.85,9.57 103.71,25.71
Outline: 120.07,7.66 arc-8 120.04,8.87
Outline: 120.04,7.58 arc87 129.04,0.05
Outline: 103.65,111.36 119.86,127.56
Outline: 129.13,136.91 arc95 120.01,128.33
Outline: 127.42,119.88 111.28,103.75
Outline: 128.11,120.08 arc99 136.89,129.53
Outline: 25.65,103.77 9.59,119.83
Outline: 0.04,127.61 arc86 8.89,120.07
Outline: 17.17,127.5 33.31,111.35
Outline: 16.98,128.23 arc9 16.93,129.52
Outline: 7.94,136.94 arc-88 16.95,129.38
Outline: 0.06,127.54 arc-12 0.05,129.26
Outline: 0.09,7.19 arc4 0.22,6.55
Outline: 9.48,119.91 arc90 9.33,120.05 9.3,120.05 arc90 9.27,120.08 8.74,120.08
Outline: 17.14,127.49 arc-90 17.03,127.61 17.03,127.64 arc-90 17,127.66 17,128.13
Outline: 119.9,127.6 arc90 119.92,127.62 119.99,128.15
Outline: 127.48,119.97 arc-90 127.64,120.13 127.72,120.13 arc90 127.74,120.11 128.07,120.11
Outline: 119.87,9.57 arc90 120.01,9.42 120.04,9.42 arc90 120.02,9.41 120.02,8.84
Outline: 17.2,9.73 arc90 17.25,9.69 17.3,9.69 arc90 17.01,9.4 17.01,9.17
Outline: 9.57,17.28 arc-90 9.45,17.16 9.42,17.16 arc-90 9.31,17.05 8.98,17.05
Outline: 7.9,0.06 arc-10 6.51,0.33
Outline: 125.07,126.08 122.95,123.3
Outline: 126.58,124.78 123.95,122.48
Outline: 122.99,123.26 123.96,122.47
Outline: 128.83,132.83 131.99,136.07
Outline: 132.86,128.93 135.99,132.06
Outline: 136.06,132.05 arc-18 136.87,129.46
Outline: 129.12,136.92 arc-20 131.99,136.15
Outline: 125.12,126.02 arc-130 128.82,132.82
Outline: 132.8,128.91 arc-122 126.61,124.76
Outline: 13.54,122.55 14.71,123.77
Outline: 10.63,124.92 13.51,122.65
Outline: 12.18,126.54 14.79,123.86
Outline: 10.66,124.96 arc-127 4.29,128.97
Outline: 8.21,132.76 arc-123 12.15,126.5
Outline: 0.04,129.43 arc-20 0.82,132.24
Outline: 4.75,136.19 arc-23 8.04,137.03
Outline: 8.23,132.76 4.76,136.16
Outline: 4.29,128.96 0.81,132.24
Outline: 122.66,13.29 123.74,14.39
Outline: 13.25,14.64 10.4,12.39
Outline: 14.31,13.61 12.06,10.86
Outline: 14.32,13.59 13.19,14.68
Outline: 4.31,8.27 arc-121 10.41,12.35
Outline: 12.07,10.87 arc-128 8.16,4.36
Outline: 4.3,8.31 0.84,4.94
Outline: 8.2,4.34 4.87,0.87
Outline: 4.87,0.85 arc11 6.35,0.32
Outline: 0.3,6.4 arc10 0.8,4.98
Outline: 122.59,13.2 124.66,10.42
Outline: 123.75,14.45 126.62,12.34
Outline: 132.74,8.09 arc124 126.61,12.31
Outline: 124.73,10.36 arc121 129,4.37
Outline: 129.04,0 arc23 132.31,0.92
Outline: 136.08,4.79 arc31 136.88,9.21
Outline: 132.72,8.1 136.11,4.84
Outline: 128.92,4.37 132.27,0.91
Outline: 127.69,16.99 127.9,16.79 128.43,16.9
Copper layers (1*2*15*16): Top 0.035559375mm / dielectric 1.501140625mm / Route2 0.035559375mm / dielectric 0.149859375mm / Route15 0.035559375mm / dielectric 0.200659375mm / Bottom 0.035559375mm
Design rules "4pcb-66board": minimum track width 6mil, minimum drill 15mil, track to track 6mil, track to pad 6mil, pad to pad 6mil, via to via 6mil, smd to smd 6mil, copper to edge 15mil, drill to drill 10mil, minimum pad ring 10mil, minimum via ring 15mil, stop-mask expansion 4mil, vias tented up to drill 0mil, thermal gap 10mil
tRestrict: area 117.8,48 to 120.8,88.1; area 67.5,67.8 to 69.5,69.4; 8 lines
bRestrict: area 118,48.1 to 120.7,88.1; area 67.5,67.8 to 69.5,69.4; 8 lines

### Footprints (pad centres in the part's own frame; a part is rotated, then mirrored left to right if it is on the bottom)
ANTENNA-CHIP5 = smd 1.016 x 2.54: FEED -3.302,0; NC 3.302,0
BALUN = smd 0.35 x 0.8: 1 -0.65,-0.8; 2 0,-0.8; 3 0.65,-0.8; 4 0.65,0.8; 5 0,0.8; 6 -0.65,0.8
BATTERY-W/HOLDER-380MAH-HUBSAN = drill 1 long: + -2.54,14.605; - 0,14.605 | hole 1.4: -7.35,-12.05; -7.35,12.05; 7.35,-12.05; 7.35,12.05
HDRV10W63P254_10X1_2540X254H838_HS = drill 1.1 pad 1.65 square: 1 0,0 | drill 1.1 pad 1.65: 2 2.54,0; 3 5.08,0; 4 7.62,0; 5 10.16,0; 6 12.7,0; 7 15.24,0; 8 17.78,0; 9 20.32,0; 10 22.86,0
CAPC2012X140_HS = smd 1.08 x 1.42: 1 -0.895,0; 2 0.895,0
CERAMIC_CAP_0805 = smd 1.08 x 1.42: 1 -0.895,0; 2 0.895,0
CAPMP7343X310_HS = smd 2.37 x 2.43: 1 -3.12,0; 2 3.12,0
SOD3716X135_HS = smd 1.25 x 0.8: A 1.665,0; C -1.665,0
2X3-NS = drill 1.016 pad 1.88 square: 1 -2.54,-1.27 | drill 1.016 pad 1.88 octagon: 2 -2.54,1.27; 3 0,-1.27; 4 0,1.27; 5 2.54,-1.27; 6 2.54,1.27
MALE_HEADER_2X1_0.1IN = drill 1.1 pad 1.65 square: 1 0,0 | drill 1.1 pad 1.65: 2 2.54,0
FTDI_BASIC = drill 1.016 pad 1.88: CTS 10.16,0; DTR 0,0; GND 12.7,0; RXI 2.54,0; TXO 5.08,0; VCC 7.62,0
LED_RING = drill 0.8: DATA_IN 4.14,31.318; DATA_OUT -12.065,29.21 | drill 0.8 square: GND 12.09,-29.185 | drill 1.1: PWR -4.14,-31.318
RESC2012X60_HS = smd 0.92 x 1.38: 1 -0.955,0; 2 0.955,0
TE_FSM8JSMA_HS = smd 1.4 x 2.1: 1 -2.25,4.55; 2 -2.25,-4.55; 3 2.25,4.55; 4 2.25,-4.55
QFN-64 = smd 1.562 x 0.28: 1 -4.881,3.75; 2 -4.881,3.25; 3 -4.881,2.75; 4 -4.881,2.25; 5 -4.881,1.75; 6 -4.881,1.25; 7 -4.881,0.75; 8 -4.881,0.25; 9 -4.881,-0.25; 10 -4.881,-0.75; 11 -4.881,-1.25; 12 -4.881,-1.75; 13 -4.881,-2.25; 14 -4.881,-2.75; 15 -4.881,-3.25; 16 -4.881,-3.75; 33 4.881,-3.75; 34 4.881,-3.25; 35 4.881,-2.75; 36 4.881,-2.25; 37 4.881,-1.75; 38 4.881,-1.25; 39 4.881,-0.75; 40 4.881,-0.25; 41 4.881,0.25; 42 4.881,0.75; 43 4.881,1.25; 44 4.881,1.75; 45 4.881,2.25; 46 4.881,2.75; 47 4.881,3.25; 48 4.881,3.75 | smd 0.28 x 1.562: 17 -3.75,-4.881; 18 -3.25,-4.881; 19 -2.75,-4.881; 20 -2.25,-4.881; 21 -1.75,-4.881; 22 -1.25,-4.881; 23 -0.75,-4.881; 24 -0.25,-4.881; 25 0.25,-4.881; 26 0.75,-4.881; 27 1.25,-4.881; 28 1.75,-4.881; 29 2.25,-4.881; 30 2.75,-4.881; 31 3.25,-4.881; 32 3.75,-4.881; 49 3.75,4.881; 50 3.25,4.881; 51 2.75,4.881; 52 2.25,4.881; 53 1.75,4.881; 54 1.25,4.881; 55 0.75,4.881; 56 0.25,4.881; 57 -0.25,4.881; 58 -0.75,4.881; 59 -1.25,4.881; 60 -1.75,4.881; 61 -2.25,4.881; 62 -2.75,4.881; 63 -3.25,4.881; 64 -3.75,4.881
MOTOR_PADS = smd 2 x 2: V+ -1,0; V- 2,0
N-CHANNELMOFSET = smd 2.9 x 2.05: P$1 0,0.934 | smd 1 x 1.5: P$2 -0.95,-1.15; P$3 0.95,-1.15
9-AXIS_IMU = smd 0.28 x 1.4: P$1 -1.53,1.775; P$6 -1.53,-1.775; P$7 -1.092,-1.775; P$8 -0.655,-1.775; P$9 -0.218,-1.775; P$10 0.219,-1.775; P$11 0.656,-1.775; P$12 1.093,-1.775; P$13 1.53,-1.775; P$18 1.53,1.775; P$19 1.093,1.775; P$20 0.656,1.775; P$21 0.219,1.775; P$22 -0.218,1.775; P$23 -0.655,1.775; P$24 -1.092,1.775 | smd 1.4 x 0.28: P$2 -1.97,0.67; P$3 -1.97,0.23; P$4 -1.97,-0.23; P$5 -1.97,-0.67; P$14 1.97,-0.67; P$15 1.97,-0.23; P$16 1.97,0.23; P$17 1.97,0.67
SOT23-DBV = smd 0.55 x 1.2: 1 -0.95,-1.3; 2 0,-1.3; 3 0.95,-1.3; 4 0.95,1.3; 5 -0.95,1.3
NET_BRIDGE = smd 1.422 x 0.711: P$1 0.762,0.508; P$2 1.524,0.508
CRYSTAL-SMD-5X3 = smd 1.9 x 1.1: 1 -1.85,-1.15; 2 1.85,-1.15; 3 1.85,1.15; 4 -1.85,1.15

### Placement (x,y rotation side)
A1  118.33,74.01 0 top
B1  112.7,74.22 180 top
BATT1  68.48,68.56 270 bottom
BREAKOUT_HEADER  21.28,56.35 90 top
C5  86.66,72.91 90 top
C6  89.17,67.7 180 top
C7  96.43,103.34 45 top
C8  113.48,77.53 90 top
C9  37.13,98.08 135 top
C10  70.57,23.27 0 top
C11  99.99,108.41 135 top
C12  111.5,77.52 270 top
C13  102.7,39.82 315 top
C14  108.15,36.61 45 top
C15  36.94,37.67 225 top
C16  35,29.67 315 top
C17  64.6,72.9 90 top
C18  36.41,106.43 45 top
C19  68.59,73.06 90 top
C20  66.61,72.9 90 top
C21  72.58,72.92 270 top
C22  70.57,72.94 270 top
C23  48.22,71.44 180 top
C24  48.27,67.56 180 top
C25  49.46,80.26 180 top
C26  91.51,63.12 180 top
C27  96.02,63.08 0 top
C28  96.93,82.75 0 top
C29  98.79,66.98 270 top
D5  26.44,95.92 315 top
D6  105.22,96.69 45 top
D7  96.85,27.75 133.9 top
D8  24.76,42.08 45 top
J1  110.28,91.32 269.7 top
J2  55.35,81.74 270 top
JP1  69.78,18.31 1.7 top
JP2  45.37,24.57 335 top
LR1  68.48,68.56 0 bottom
R1  100.45,82.8 180 top
R2  61.01,70.85 270 top
R3  62.91,66.58 90 top
R4  101.04,96.92 135 top
R5  41.03,102.11 315 top
R6  93.9,106.13 225 top
R7  98.13,38.88 315 top
R8  97.95,35.39 135 top
R9  38.02,43.81 225 top
R10  40.65,37.63 45 top
R12  46.59,103.24 135 top
SW1  63.7,26.9 180 top
U1  94.22,75.26 180 top
U$1  29.16,101.22 225 top
U$2  33.04,94.63 225 top
U$3  68.48,68.56 0 top
U$4  108.3,102.29 135 top
U$5  102.93,100.47 135 top
U$6  101.91,30.22 225 top
U$7  95.31,33.19 45 top
U$8  27.69,37.21 315 top
U$9  31.43,41.59 315 top
U$10  50.62,76.5 270 top
U$11  49.46,70.07 180 top
Y1  94.36,66.44 0 top

### Tracks (layer width: path | path; a pad name or v marks a point on that pad's centre or on a via)
BAT_GND  (via drill 0.38)
  Top 0.457: 37.24,37.02 36.32,37.02 C15.2 36.09,37.09 33.12,40.06 31.29,40.06 U$9.P$3 | 37.24,37.02 v39.44,34.42 39.9,37.02 R10.1 | 37.24,37.02 37.24,27.49 C16.2 | U$7.P$3 96.83,33.05 98.43,34.65 98.58,34.65 R8.1 98.81,34.8 v101.02,37.02 103.15,39.15 103.3,39.15 C13.2 103.45,39 103.61,38.84 110.31,38.84 C14.2 | U$5.P$3 103,102.01 99.19,102.01 97.28,103.92 C7.2 97.05,104 v95.84,105.21 94.62,106.43 94.62,106.74 R6.1 94.69,106.97 97.74,110.02 97.74,110.55 C11.2 | C9.2 36.55,98.74 v38.95,101.16 40.28,102.47 40.28,102.78 R5.1 40.13,102.93 38.69,104.38 38.69,108.57 C18.2 | v45.47,80.3 48.52,80.3 C25.2 | v30.68,93.86 31.52,94.7 U$2.P$3 | U$11.P$1 53.87,69.56 BATT1.-
  Route15 0.457: v45.47,80.3 45.25,80.3
  Bottom 0.457: v45.47,80.3 45.47,77.1 53.85,68.71 53.85,68.56 BATT1.-
  pour Route15: 110.21,98.24 102.72,91.39 79.83,111.76 55.47,108.47 45.62,82.07 45.26,81.77 45.17,58.91 51.98,41.36 53.78,37.22 79.24,32.93 105.3,52.5 115.76,44.59 109.65,31.73 89.92,12.27 45.65,14.69 30.45,22.69 12.1,44.36 8.34,73.08 14.95,98.06 24.89,110.15 40.84,120.97 58.43,126.72 83.16,126.72 100.38,119.73 106.18,115.91 116.16,105.67
GND  (via drill 0.38, 0.4)
  Top 0.152: SW1.3 61.39,22.31 59.95,22.31 56.9,19.26 JP2.GND | SW1.3 61.47,22.38 61.47,31.38 SW1.4 61.47,31.53 61.47,34.35 56.44,39.38 LR1.GND | JP1.GND 82.42,18.65 81.66,18.65 80.14,17.13 66.8,17.13 61.55,22.38 SW1.3 | 97.89,81.21 97.89,80.22 U1.17 | 97.89,81.21 97.89,82.73 C28.2 | 97.89,81.21 96.75,81.21 96.52,80.98 96.52,80.14 U1.20 | U1.18 97.51,80.14 97.89,80.14 U1.17 | 98.23,74.47 98.27,74.51 99.03,74.51 U1.7 | 98.23,74.47 96.52,72.75 v96.52,71.91 96.52,70.39 U1.61 96.52,70.31 96.52,69.55 96.9,69.17 98.96,69.17 99.8,68.33 99.8,67.42 98.65,66.28 C29.2 | 98.23,75.91 98.05,75.72 98.05,74.66 98.23,74.47 | 98.23,75.91 98.27,75.95 99.03,75.95 U1.10 99.11,76.03 99.11,76.49 U1.11 99.19,76.49 104.22,76.49 105.21,77.48 107.8,77.48 v107.86,77.49 | 98.23,75.91 98.05,76.11 98.05,80.07 U1.17 | C29.2 98.81,66.05 96.98,64.22 96.98,63.15 C27.2 95.91,62.08 91.95,62.08 90.96,63.08 90.65,63.08 C26.2 | 93.47,70.31 U1.55 93.6,70.51 93.6,71.26 93.73,71.39 94.7,71.39 94.84,71.26 94.84,70.45 94.91,70.38 U1.58 95,70.31 95,69.55 96.14,68.41 97.28,68.41 97.82,67.88 97.82,67.04 98.73,66.12 C29.2 | U1.45 89.28,72.98 88.52,72.98 87.61,72.07 86.69,72.07 C5.1 86.61,72.07 v83.8,72.07 74.27,72.07 72.59,73.74 C21.1 72.52,73.82 70.61,73.82 C22.1 70.54,73.82 68.63,73.82 C19.2 | 88.29,78.54 88.29,78.77 88.52,79 89.28,79 U1.33 89.36,79.08 94.16,79.08 94.46,79.38 94.46,80.07 U1.24 | 88.29,78.54 88.29,78.24 88.44,78.09 89.28,78.09 U1.35 | 47.37,71.46 v47.37,73.13 47.37,74.81 49.05,76.49 49.28,76.49 U$10.2 | 47.37,71.46 C23.2 | U$3.P$20 69.17,70.31 69.55,70.31 U$3.P$19 69.62,70.31 70,70.31 U$3.P$18
  Top 0.152: U$3.P$14 70.46,67.95 70.46,68.26 U$3.P$15 70.46,68.41 70.46,68.71 U$3.P$16 70.46,68.87 70.46,69.17 U$3.P$17 70.38,69.25 70,69.63 70,70.24 U$3.P$18 | 65.66,73.82 66.57,73.82 C20.2 | 65.66,73.82 64.67,73.82 C17.2 | v47.37,66.12 47.37,67.5 C24.2 | v89.66,69.17 90.04,68.79 90.04,67.72 C6.1 | v65.66,74.96 65.66,73.82 | v72.54,70.31 70.08,70.31 U$3.P$18 | v87.76,78.54 88.29,78.54 | U$11.P$2 47.37,69.56 47.37,71.46
  Bottom 0.152: v47.37,73.13 41.35,79.15 21.31,79.15 BREAKOUT_HEADER.10
  other vias: 107.84,79.68 110.79,80.67 115.3,77.45 107.89,72.02 107.93,69.83 110.43,69.8 112.9,69.76 114.77,70.85
  pour Route2: 106.64,68.04 115.68,68.01 115.85,81.82 106.82,81.81
  pour Route15 (rank 2): 113.17,96.33 102.43,89.29 79.3,110.13 56.65,107.21 46.52,81.59 46.55,59.05 55.33,38.32 78.77,34.75 103.88,58.13 116.23,49.5 116.53,93.85 114.78,97.44
  pour Route2: 106.65,68.14 115.67,68.12 115.85,81.86 106.83,81.79
  pour Top: 106.65,67.96 115.75,68.05 115.85,81.78 106.8,81.83
MISO
  Top 0.152: U1.39 89.28,76.03 88.52,76.03 86.61,77.94 86.61,79.53 100.94,93.86 109.02,93.86 J1.1
MOSI  (via drill 0.38)
  Top 0.152: v90.88,77.25 90.2,76.56 89.36,76.56 U1.38
  Bottom 0.152: v90.88,77.25 90.88,77.48 100.86,87.46 100.86,95.08 101.4,95.61 105.06,95.61 108.1,92.56 110.31,92.56 111.53,91.35 J1.4
N$1
  Top 0.457: R12.2 45.85,103.84 43.48,101.48 41.73,101.48 R5.2 41.58,101.33 37.77,97.52 C9.1 37.54,97.37 34.19,94.01 33.73,94.01 U$2.P$1
N$2
  Top 0.457: R6.2 93.24,105.44 93.24,105.29 95.76,102.78 C7.1 95.99,102.62 100.41,98.2 R4.2 100.41,97.67 100.41,97.97 102.24,99.8 U$5.P$1
N$4
  Top 0.457: 113.36,75.04 113.36,76.49 113.44,76.56 C8.1 | 113.36,75.04 B1.1 | 113.36,75.04 113.97,75.04 114.96,74.05 A1.FEED
N$5
  pour Route15: 106.1,82.21 106.1,67.26 106.23,67.13 116.34,67.6 116.35,82.43 116.13,82.42 106.31,82.42
N$8
  Top 0.152: B1.2 112.67,75.04 112.67,75.42 111.53,76.56 C12.2
N$10
  Top 0.152: C10.1 69.7,23.22 69.7,18.42 69.77,18.35 JP1.DTR
N$13
  Top 0.457: D6.A 106.35,97.9 106.35,98.66 104.44,100.57 U$5.P$2 104.52,100.79 106.88,103.16 106.88,103.69 U$4.V-
N$14
  Top 0.457: C13.1 102.01,40.44 101.02,40.44 98.96,38.39 R7.2 98.73,38.16 97.28,36.71 97.28,36.1 R8.2 97.13,35.87 95.15,33.89 94.69,33.89 U$7.P$1
N$16
  Top 0.457: 27.64,96.15 27.64,99.73 27.71,99.8 U$1.V- | 27.64,96.15 27.64,94.78 D5.A | 27.64,96.15 32.89,96.15 U$2.P$2
N$17
  Top 0.457: U$7.P$2 95.45,31.68 95.68,31.45 95.68,29.01 D7.A 95.84,28.86 100.48,28.86 U$6.V-
N$18
  Top 0.457: 37.39,42.27 37.39,38.46 37.54,38.31 C15.1 37.77,38.31 41.28,38.31 R10.2 | 37.39,42.27 37.39,43.11 R9.2 | 37.39,42.27 32.13,42.27 U$9.P$1
N$19
  Top 0.457: D8.A 25.96,43.19 28.24,43.19 29.92,41.51 U$9.P$2 29.77,41.28 29.16,40.67 29.16,35.87 U$8.V-
N$21
  Top 0.152: U$3.P$24 67.34,70.39 67.34,71.3 66.65,71.99 C20.1
N$23
  Top 0.152: U$3.P$21 68.77,70.4 68.77,71.13 68.9,71.27 69.71,71.27 C22.2
N$24
  Top 0.152: C26.1 92.41,63.15 92.41,65.21 92.48,65.28 Y1.1 92.51,66.26 93.92,66.26 93.92,70.38 U1.56
N$25
  Top 0.457: BATT1.+ 53.92,71.15 53.92,77.78 55.3,79.15 J2.2
N$27
  Top 0.457: U$10.4 51.87,75.5 51.87,74.2 49.12,71.46 C23.1
N$30
  cutout Route2: 117.99,88.06 117.77,47.97 120.46,48.46 121.14,87.92
  cutout Route15: 117.95,48.12 120.4,48.32 121.11,87.98 118.03,88.04
N$36
  Top 0.152: B1.4 111.99,73.44 105.82,73.44 104.29,74.96 99.11,74.96 U1.8
N$37
  Top 0.152: B1.3 111.99,75.04 104.67,75.04 104.22,75.5 99.11,75.5 U1.9
N$40
  Top 0.152: C29.1 98.73,67.95 98.2,67.95 97.28,68.87 96.67,68.87 95.99,69.55 95.99,70.31 U1.60
N$41
  Top 0.152: C28.1 95.99,82.73 95.99,80.14 U1.21 95.91,80.14 95.53,80.14 U1.22
N$43
  Top 0.152: C27.1 95.07,63.15 95.07,64.6 95,64.68 95,66.43 96.14,67.57 Y1.3 96.14,67.65 94.54,69.25 94.54,70.31 U1.57
PB4
  Top 0.152: U1.40 89.28,75.57 88.52,75.57 64.36,99.73 64.36,99.88 LR1.DATA_IN
PB5
  Top 0.152: 47.18,94.97 21.31,69.09 BREAKOUT_HEADER.6 | 47.18,94.97 47.22,95 47.22,102.55 R12.1 | U1.41 89.28,75.04 83.11,75.04 63.22,94.93 47.22,94.93 47.18,94.97
PE3  (via drill 0.38)
  Top 0.152: 89.85,62.43 89.81,62.47 89.81,65.97 90.88,67.04 90.88,68.79 90.5,69.17 90.5,70.31 U1.49 | 89.85,62.43 97.44,54.85 97.44,39.61 R7.1 | v78.39,55.23 82.65,55.23 89.85,62.43
  Bottom 0.152: v78.39,55.23 20.4,55.23 20.17,55.46 20.17,64.37 21.23,65.44 21.23,66.5 BREAKOUT_HEADER.5
PE4  (via drill 0.38)
  Top 0.152: 38.65,46.58 21.31,63.91 BREAKOUT_HEADER.4 | 38.65,46.58 38.69,46.54 38.69,44.56 R9.1 | v90.81,65.82 91.19,66.2 91.19,68.94 91.03,69.09 91.03,70.31 U1.50 | v58.8,62.47 54.53,62.47 38.65,46.58
  Bottom 0.152: v90.81,65.82 62.15,65.82 v58.8,62.47
PE5  (via drill 0.38)
  Top 0.152: v101.7,94.78 101.7,96.22 R4.1 | v92.03,68.87 92.03,69.02 91.49,69.55 91.49,70.31 U1.51
  Bottom 0.152: v101.7,94.78 101.7,82.66 91.26,72.22 91.26,71.23 | 91.26,71.23 91.26,69.63 v92.03,68.87 | 91.26,71.23 83.49,71.23 83.41,71.3 65.58,71.3 64.9,70.62 64.9,70.01 61.24,66.35 58.95,66.35 54.08,61.47 21.31,61.47 BREAKOUT_HEADER.3
RESET  (via drill 0.38)
  Top 0.152: 67.75,24.18 65.96,22.38 SW1.1 | 67.75,24.18 67.79,24.21 70.23,24.21 71.15,23.3 71.45,23.3 C10.2 | 67.75,24.18 65.96,25.97 65.96,31.38 SW1.2 66.04,31.38 72.14,31.38 v73.2,32.44 | U1.12 99.11,77.02 99.87,77.02 101.4,78.54 101.4,82.73 R1.1 101.47,82.81 107.42,88.75 108.94,88.75 J1.5
  Bottom 0.152: v73.2,32.44 73.2,33.13 104.67,64.6 104.67,84.49 108.94,88.75 J1.5
RX0
  Top 0.152: U1.46 89.28,72.45 88.52,72.45 88.29,72.22 88.29,69.17 89.05,68.41 89.05,67.04 74.88,52.86 74.88,18.5 JP1.TXO
RX1  (via drill 0.38)
  Top 0.152: v91.49,82.05 91.87,82.05 92.94,80.98 92.94,80.14 U1.27 | v59.64,67.5 59.64,44.79 46.69,31.83 46.69,24.21 46.38,23.91 46.38,22.99 47.14,22.23 49.81,22.23 49.96,22.38 JP2.TXO
  Bottom 0.152: v91.49,82.05 74.19,82.05 v59.64,67.5
SCK
  Top 0.152: U1.37 89.28,77.02 88.14,77.02 86.92,78.24 86.92,79.38 98.81,91.27 108.94,91.27 J1.3
SCL  (via drill 0.38)
  Top 0.152: 64.06,69.86 65.89,69.86 66,69.74 | 64.06,69.86 61.01,69.86 R2.2 | 66,69.74 66.5,69.25 U$3.P$2 | v94.01,81.75 94.01,80.14 U1.25 | 64.06,69.86 v64.06,70.31 | v66.04,70.16 66.04,69.78 66,69.74
  Bottom 0.152: v94.01,81.75 92.33,81.75 82.19,71.61 65.36,71.61 v64.06,70.31 | v66.04,70.16 61.62,65.74 59.26,65.74 49.89,56.37 21.31,56.37 BREAKOUT_HEADER.1
SDA  (via drill 0.38)
  Top 0.152: 65.09,67.69 65.74,68.33 66.5,68.33 U$3.P$4 | 65.09,67.69 64.97,67.57 62.92,67.57 R3.2 | v92.56,82.89 92.56,82.05 93.4,81.21 93.4,80.14 U1.26 | v65.05,67.72 65.09,67.69
  Route2 0.152: v92.56,82.89 89.2,82.89 74.04,67.72 v65.05,67.72
  Bottom 0.152: v65.05,67.72 66.88,69.55 66.88,70.47 66.34,71 65.74,71 65.2,70.47 65.2,69.86 61.39,66.05 59.11,66.05 52.02,58.96 21.31,58.96 BREAKOUT_HEADER.2
TX0  (via drill 0.38)
  Top 0.152: v92.1,71.91 92.03,71.99 89.36,71.99 U1.47
  Bottom 0.152: v92.1,71.91 92.1,69.93 92.86,69.17 92.86,53.25 72.36,32.75 72.36,18.42 JP1.RXI
TX1  (via drill 0.38)
  Top 0.152: v89.59,80.91 89.89,81.21 92.18,81.21 92.41,80.98 92.41,80.14 U1.28 | v60.94,67.19 60.94,45.63 47.68,32.37 47.68,23.53 JP2.RXI
  Bottom 0.152: v89.59,80.91 73.51,80.91 60.94,68.33 v60.94,67.19
V3
  Top 0.152: 51.68,71.11 49.2,68.64 49.2,68.56 | 51.68,71.11 52.78,72.22 52.78,75.95 51.94,76.79 51.94,77.4 U$10.5 | 49.2,68.56 49.2,67.57 C24.1 | 49.2,68.56 46.91,68.56 46.3,67.95 20.85,67.95 20.17,68.64 20.17,69.48 21.23,70.54 21.23,71.53 BREAKOUT_HEADER.7 | 93.21,71.42 93.53,71.87 95.44,71.87 95.45,71.15 95.45,70.39 U1.59 | 93.21,71.42 93.02,71.23 93.02,70.39 U1.54 | 91.76,73.4 91.72,73.44 89.36,73.44 U1.44 89.28,73.52 88.52,73.52 88.29,73.74 86.69,73.74 C5.2 86.61,73.82 74.04,73.82 73.2,74.76 67.95,74.78 67.64,74.44 67.64,72.83 | 91.76,73.4 93.17,71.99 93.17,71.46 93.21,71.42 | R1.2 99.26,82.81 98.35,83.73 95.53,83.73 95,83.19 95,80.14 U1.23 94.92,80.07 94.92,79.31 94.16,78.54 91.8,78.54 | 91.8,78.54 89.36,78.54 U1.34 | 91.8,78.54 91.8,73.44 91.76,73.4 | U$3.P$13 70,66.73 70,66.05 69.77,65.82 68.02,65.82 67.87,65.97 67.87,66.73 U$3.P$8 67.79,66.81 67.41,66.81 U$3.P$7 67.34,66.81 66.95,66.81 U$3.P$6 | U$3.P$6 66.88,66.73 65.81,65.67 62.92,65.67 R3.1 62.92,65.74 61.93,66.73 61.93,67.95 61.96,67.99 | U$3.P$5 66.57,67.88 66.57,67.11 66.88,66.81 U$3.P$6 | 61.96,67.99 62.76,68.79 66.5,68.79 U$3.P$3 | C17.1 64.59,71.99 64.44,71.84 61.01,71.84 R2.1 60.94,71.76 60.02,70.85 60.02,70.09 | U$3.P$1 66.88,70.39 66.88,70.47 66.12,71.23 65.43,71.23 64.67,71.99 C17.1 | U$3.P$23 67.87,70.31 68.25,70.31 U$3.P$22 68.33,70.39 68.33,71.15 68.55,71.38 68.55,71.99 C19.1 | C19.1 68.63,72.07 69.39,72.83 71.22,72.83 71.98,72.07 72.52,72.07 C21.2 72.59,71.99 76.86,67.72 88.22,67.72 C6.2 | 67.64,72.83 65.89,72.83 64.9,71.84 C17.1 | 67.64,72.83 68.48,71.99 C19.1 | 60.02,70.09 60.02,69.48 61.47,68.03 61.93,68.03 61.96,67.99
  Top 0.152: 51.68,71.11 52.71,70.09 60.02,70.09
  pour Route2 (rank 2): 113.17,96.33 102.4,89.26 79.52,110.15 56.58,107.14 46.66,81.6 46.57,59.13 55.36,38.35 78.97,34.69 103.88,58.13 116.23,49.45 116.53,93.8 114.78,97.44
VBAT  (via drill 0.38)
  Top 0.457: D8.C 23.6,40.9 23.98,40.9 v25.43,39.45 26.95,37.93 U$8.V+ 27.03,37.7 27.03,35.87 30.99,31.91 32.74,31.91 C16.1 | 107.57,97.9 108.94,99.27 108.94,101.56 U$4.V+ 108.94,101.78 108.94,103.61 106.35,106.2 102.24,106.2 C11.1 | 107.57,97.9 105.21,95.54 104.06,95.54 D6.C | 25.27,98.43 25.27,99.35 27.79,101.86 29.85,101.86 U$1.V+ 30.07,102.01 32.28,104.22 C18.1 | 25.27,98.43 25.27,97.14 D5.C | D7.C 98.05,26.58 v99.42,26.58 100.25,26.58 102.54,28.86 102.54,30.92 U$6.V+ 102.69,31.15 105.89,34.35 C14.1 | v72.67,34.2 72.67,37.24 LR1.PWR | 49.89,77.4 50.34,76.94 50.34,76.11 49.81,75.57 49.35,75.57 U$10.3 | 49.89,77.4 49.35,77.4 U$10.1 | 49.89,77.4 50.34,77.86 50.34,80.22 C25.1 50.57,80.3 53.92,80.3 55.3,81.67 J2.1 | v25.43,98.43 25.27,98.43 | v107.72,97.75 107.57,97.9
  Route2 0.457: v72.67,34.2 72.64,34 | 48.09,88.83 48.29,88.75 55.3,81.75 J2.1
  pour Route2: 110.21,98.24 102.59,91.36 79.83,111.76 55.38,108.45 45.59,82.08 45.12,81.62 45.16,58.97 50.47,44.1 53.87,36.96 79.13,32.97 105.3,52.5 115.76,44.59 109.65,31.73 89.92,12.27 45.65,14.69 30.45,22.69 12.1,44.36 8.34,73.08 14.95,98.06 24.89,110.15 40.84,120.97 58.43,126.72 83.16,126.72 100.38,119.73 106.18,115.91 116.16,105.67

### Text on the board
tPlace: GND | BAT_GND | VBAT | V3 | PB5 | PE3 | PE4 | PE5 | SDA | SCL